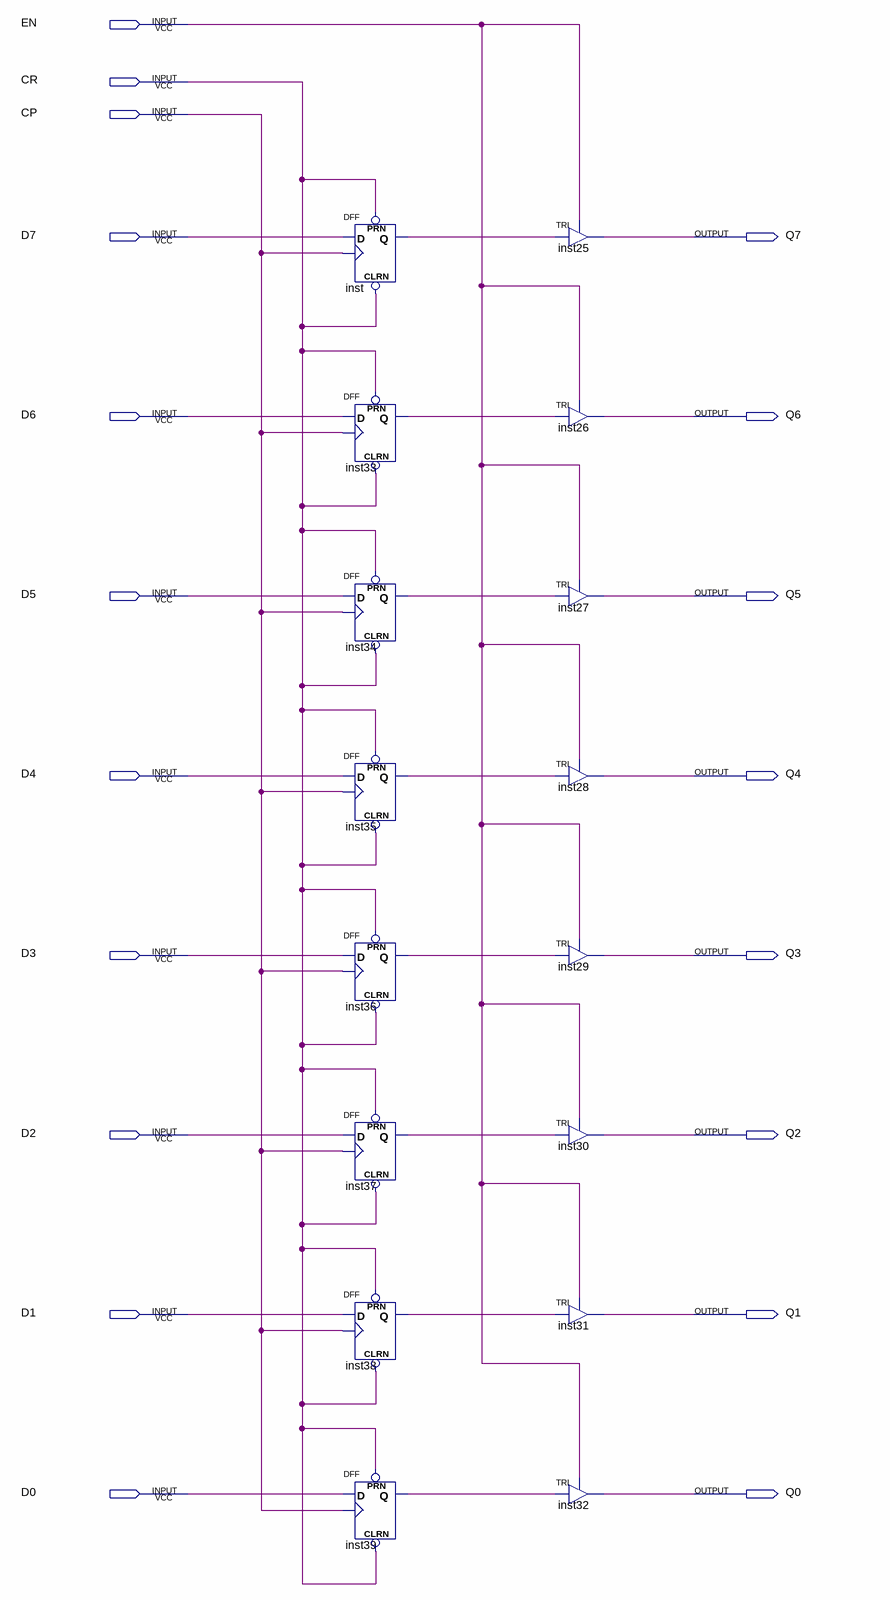
[diagram p0: schematic sheet]
// Quartus schematic Rigister8bitE.bdf as structural Verilog: 16 symbols, 19 pins
module Rigister8bitE (
  input  EN,
  input  CR,
  input  CP,
  input  D7,
  input  D6,
  input  D5,
  input  D4,
  input  D3,
  input  D2,
  input  D1,
  input  D0,
  output Q7,
  output Q6,
  output Q5,
  output Q4,
  output Q3,
  output Q2,
  output Q1,
  output Q0
);

  wire inst33_q, inst34_q, inst35_q, inst36_q, inst37_q, inst38_q, inst39_q, inst_q;

  DFF inst (.CLRN(CR), .CLK(CP), .D(D7), .PRN(CR), .Q(inst_q));
  DFF inst33 (.CLRN(CR), .CLK(CP), .D(D6), .PRN(CR), .Q(inst33_q));
  DFF inst34 (.CLRN(CR), .CLK(CP), .D(D5), .PRN(CR), .Q(inst34_q));
  DFF inst35 (.CLRN(CR), .CLK(CP), .D(D4), .PRN(CR), .Q(inst35_q));
  DFF inst36 (.CLRN(CR), .CLK(CP), .D(D3), .PRN(CR), .Q(inst36_q));
  DFF inst37 (.CLRN(CR), .CLK(CP), .D(D2), .PRN(CR), .Q(inst37_q));
  DFF inst38 (.CLRN(CR), .CLK(CP), .D(D1), .PRN(CR), .Q(inst38_q));
  DFF inst39 (.CLRN(CR), .CLK(CP), .D(D0), .PRN(CR), .Q(inst39_q));
  TRI inst25 (.IN(inst_q), .OE(EN), .OUT(Q7));
  TRI inst26 (.IN(inst33_q), .OE(EN), .OUT(Q6));
  TRI inst27 (.IN(inst34_q), .OE(EN), .OUT(Q5));
  TRI inst28 (.IN(inst35_q), .OE(EN), .OUT(Q4));
  TRI inst29 (.IN(inst36_q), .OE(EN), .OUT(Q3));
  TRI inst30 (.IN(inst37_q), .OE(EN), .OUT(Q2));
  TRI inst31 (.IN(inst38_q), .OE(EN), .OUT(Q1));
  TRI inst32 (.IN(inst39_q), .OE(EN), .OUT(Q0));
endmodule
